# Altium schematic sheet BPod Panel Due.SchDoc
size 297 x 209 mm; CompanyName: Sainsbury Wellcome Centre; Organization: FabLab; Address1: Sainsbury Wellcome Centre; Address2: 25 Howland Street; Address3: London; Address4: W1T 4JG; DocumentNumber: 1; SheetNumber: 1; SheetTotal: 12; swcgroup: FabLab; Org: Sainsbury Wellcome Centre; Add1: 25 Howland Street; Add2: London; Add3: W1T 4JG; WebAddress: www.sainsburywellcome.org; SheetSize: A4; SheetName: BPod Panel Due
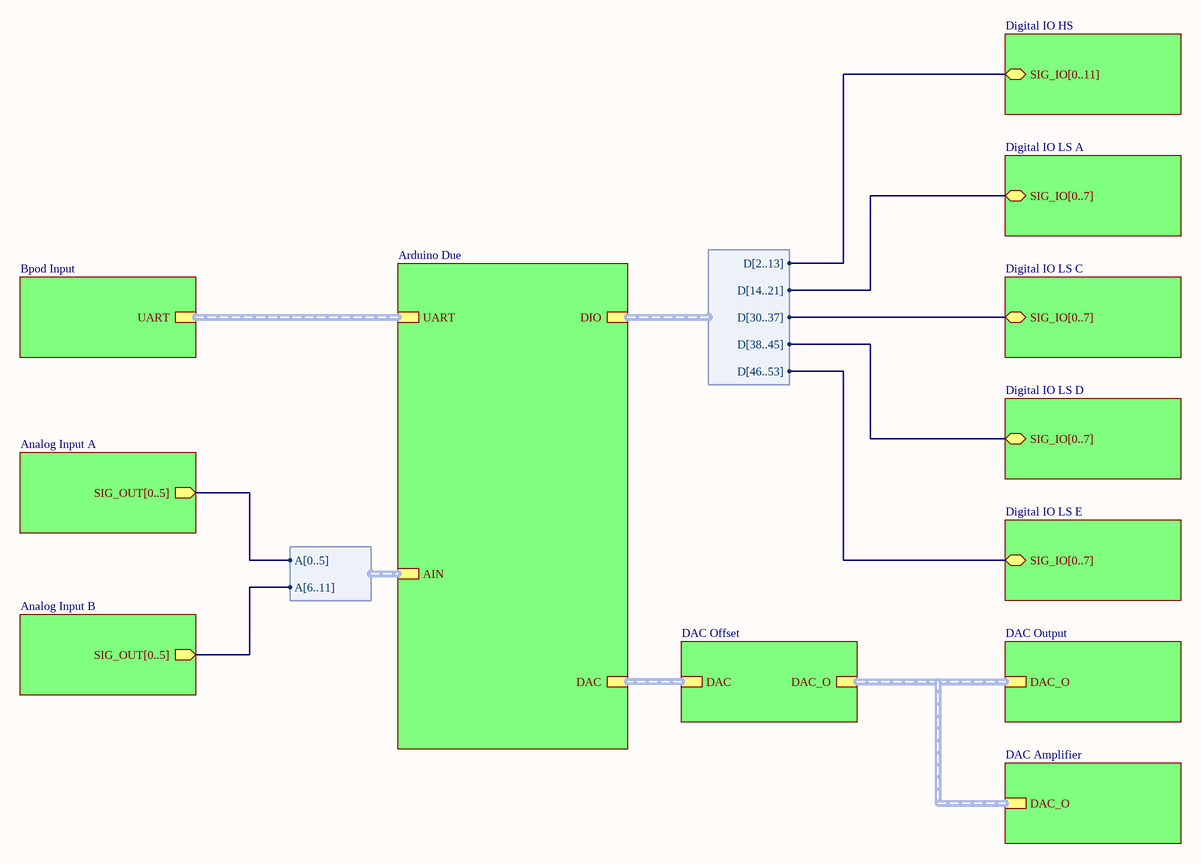
[diagram p0: BPod Panel Due.SchDoc]

## Sub-sheets
Analog Input A = Analog Input.SchDoc: SIG_OUT[0..5] (out)
Analog Input B = Analog Input.SchDoc: SIG_OUT[0..5] (out)
Arduino Due = Arduino Due.SchDoc: AIN (harness AIN), DAC (harness DAC), DIO (harness DIO), UART (harness UART)
Bpod Input = Bpod Input.SchDoc: UART (harness UART)
DAC Amplifier = DAC Amplifier.SchDoc: DAC_O (harness DAC_O)
DAC Offset = DAC Offset.SchDoc: DAC (harness DAC), DAC_O (harness DAC_O)
DAC Output = DAC Output.SchDoc: DAC_O (harness DAC_O)
Digital IO HS = Digital IO HS.SchDoc: SIG_IO[0..11] (bidir)
Digital IO LS A = Digital IO LS.SchDoc: SIG_IO[0..7] (bidir)
Digital IO LS C = Digital IO LS.SchDoc: SIG_IO[0..7] (bidir)
Digital IO LS D = Digital IO LS.SchDoc: SIG_IO[0..7] (bidir)
Digital IO LS E = Digital IO LS.SchDoc: SIG_IO[0..7] (bidir)

## Harnesses
AIN: A[6..11], A[0..5]
DIO: D[2..13], D[14..21], D[30..37], D[38..45], D[46..53]

## Buses and harness runs
harness sheet Arduino Due/DAC = sheet DAC Offset/DAC
harness sheet Arduino Due/UART = sheet Bpod Input/UART
harness sheet DAC Amplifier/DAC_O = sheet DAC Offset/DAC_O = sheet DAC Output/DAC_O

## Notes on the sheet
- FILE
- VARIANT
- DATE
- REVISION
- SHEET
- /
- PROJECT
- SIZE